# EAGLE design DRV8840 pcbway optimized (EAGLE 9.5.1)
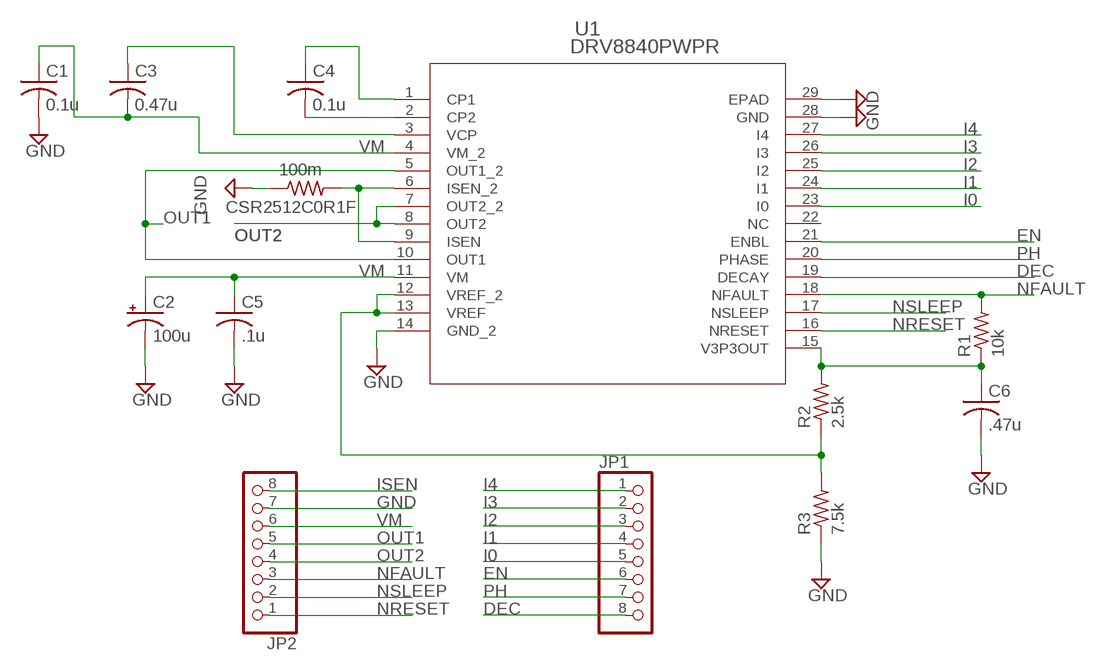
[diagram p0: schematic, sheet 1]

## Parts
C1  0.1u  C-US025-024X044  [C025-024X044]
C2  100u  CPOL-USE2.5-6  [E2,5-6]
C3  0.47u  C-USC1206  [C1206]
C4  0.1u  C-USC1206  [C1206]
C5  .1u  C-US025-024X044  [C025-024X044]
C6  .47u  C-US025-024X044  [C025-024X044]
CSR2512C0R1F  100m  R-US_R2512  [R2512]
JP1  PINHD-1X8  [1X08]
JP2  PINHD-1X8  [1X08]
R1  10k  R-US_0204/2V  [0204V]
R2  2.5k  R-US_0207/10  [0207/10]
R3  7.5k  R-US_0207/10  [0207/10]
U1  DRV8840PWPR  [PWP28_5P18X3P1]

## Nets
DEC: JP1.8 U1.19(DECAY)
EN: JP1.6 U1.21(ENBL)
GND: C1.2 C2.- C5.2 C6.2 CSR2512C0R1F.1 JP2.7 R3.1 U1.14(GND_2) U1.28(GND) U1.29(EPAD)
I0: JP1.5 U1.23(I0)
I1: JP1.4 U1.24(I1)
I2: JP1.3 U1.25(I2)
I3: JP1.2 U1.26(I3)
I4: JP1.1 U1.27(I4)
ISEN: CSR2512C0R1F.2 JP2.8 U1.6(ISEN_2) U1.9(ISEN)
N$2: C6.1 R1.1 R2.2 U1.15(V3P3OUT)
N$4: C4.2 U1.2(CP2)
N$5: C3.1 U1.3(VCP)
N$10: C4.1 U1.1(CP1)
N$11: R2.1 R3.2 U1.12(VREF_2) U1.13(VREF)
NFAULT: JP2.3 R1.2 U1.18(NFAULT)
NRESET: JP2.1 U1.16(NRESET)
NSLEEP: JP2.2 U1.17(NSLEEP)
OUT1: JP2.5 U1.5(OUT1_2) U1.10(OUT1)
OUT2: JP2.4 U1.7(OUT2_2) U1.8(OUT2)
PH: JP1.7 U1.20(PHASE)
VM: C1.1 C2.+ C3.2 C5.1 JP2.6 U1.4(VM_2) U1.11(VM)
Unconnected: U1.22(NC)

## Library data of the parts
C1 C3-C6 = rcl:C-US: CAPACITOR, American symbol; SPICEPREFIX: C
C2 = rcl:CPOL-US: POLARIZED CAPACITOR, American symbol; SPICEPREFIX: C
CSR2512C0R1F R1-R3 = rcl:R-US_: RESISTOR, American symbol; SPICEPREFIX: R
JP1 JP2 = pinhead:PINHD-1X8: PIN HEADER
U1 = wobbleBot:DRV8840PWPR; MANUFACTURER_PART_NUMBER: DRV8840PWPR; VENDOR: Texas Instruments

## Board
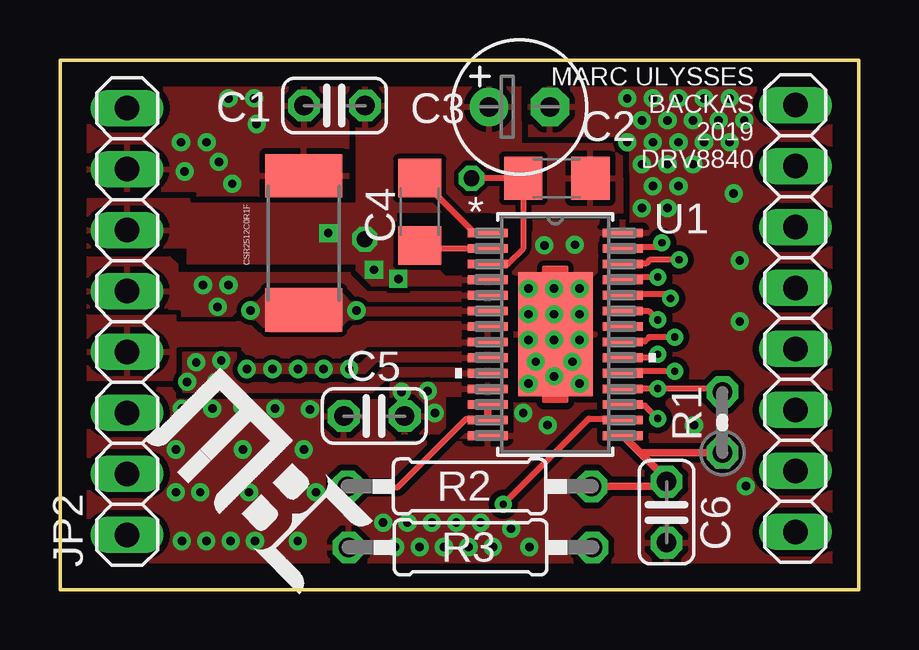
[diagram p1: board, top side]
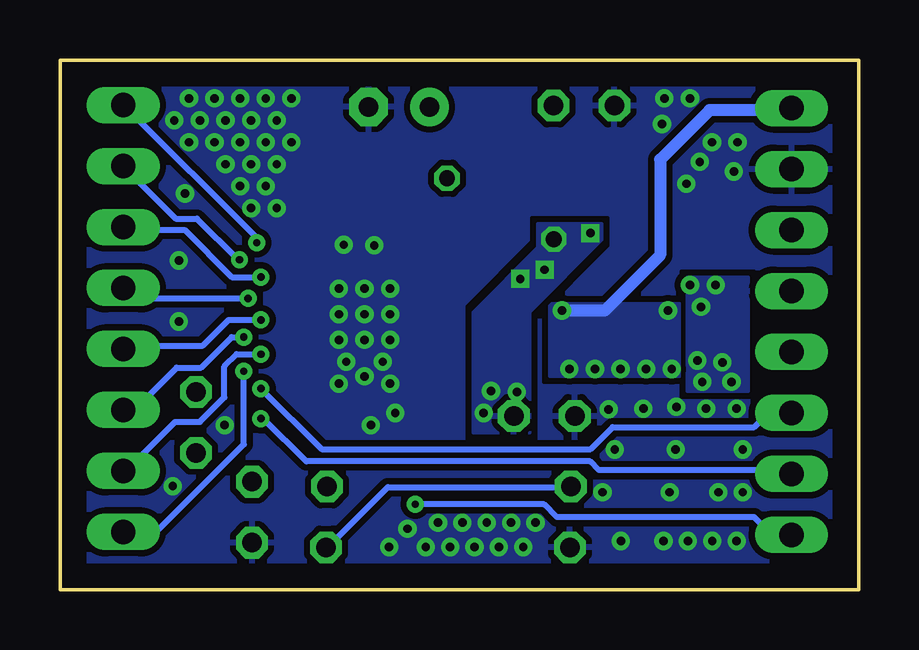
[diagram p2: board, bottom side, seen from below]

Size 33.27 x 22.07 mm. Coordinates in mm from the lower left corner, seen from the top.
Outline: 0,0 0,22.07 33.27,22.07 33.27,0 0,0
Copper layers (1*16): Top 0.035mm / dielectric 1.5mm / Bottom 0.035mm
Design rules "PCBway": minimum track width 6mil, minimum drill 0.3mm, track to track 0.205mm, track to pad 0.205mm, pad to pad 0.205mm, via to via 0.205mm, smd to smd 8mil, copper to edge 40mil, drill to drill 8mil, minimum pad ring 10mil, minimum via ring 8mil, stop-mask expansion 4mil, vias tented up to drill 25mil, thermal gap 10mil

### Footprints (pad centres in the part's own frame; a part is rotated, then mirrored left to right if it is on the bottom)
C025-024X044 = drill 0.813 octagon: 1 -1.27,0; 2 1.27,0
E2,5-6 = drill 0.813 pad 1.6: + -1.27,0 | drill 0.813 pad 1.6 octagon: - 1.27,0
C1206 = smd 1.6 x 1.8: 1 -1.4,0; 2 1.4,0
R2512 = smd 1.8 x 3.2: 1 -2.8,0; 2 2.8,0
1X08 = drill 1.016 long: 1 -8.89,0; 2 -6.35,0; 3 -3.81,0; 4 -1.27,0; 5 1.27,0; 6 3.81,0; 7 6.35,0; 8 8.89,0
0204V = drill 0.813 octagon: 1 -1.27,0; 2 1.27,0
0207/10 = drill 0.813 octagon: 1 -5.08,0; 2 5.08,0
PWP28_5P18X3P1 = smd 1.665 x 0.365: 1 -2.819,4.225; 2 -2.819,3.575; 3 -2.819,2.925; 4 -2.819,2.275; 5 -2.819,1.625; 6 -2.819,0.975; 7 -2.819,0.325; 8 -2.819,-0.325; 9 -2.819,-0.975; 10 -2.819,-1.625; 11 -2.819,-2.275; 12 -2.819,-2.925; 13 -2.819,-3.575; 14 -2.819,-4.225; 15 2.819,-4.225; 16 2.819,-3.575; 17 2.819,-2.925; 18 2.819,-2.275; 19 2.819,-1.625; 20 2.819,-0.975; 21 2.819,-0.325; 22 2.819,0.325; 23 2.819,0.975; 24 2.819,1.625; 25 2.819,2.275; 26 2.819,2.925; 27 2.819,3.575; 28 2.819,4.225 | smd 3.1 x 5.18: 29 0,0

### Placement (x,y rotation side)
C1  11.44,20.17 180 top
C2  19.15,20.12 0 top
C3  20.7,17.14 0 top
C4  14.99,15.75 270 top
C5  13.09,7.24 180 top
C6  25.27,3.23 270 top
CSR2512C0R1F  10.16,14.45 270 top
JP1  30.64,11.3 270 top
JP2  2.79,11.18 90 top
R1  27.6,6.97 90 top
R2  17.07,4.31 0 top
R3  17.11,1.77 0 top
U1  20.64,10.64 0 top

### Tracks (layer width: path | path; a pad name or v marks a point on that pad's centre or on a via)
DEC  (via drill 0.3)
  Top 0.152: 23.47,9.1 U1.19
  Top 0.254: v25.62,9.1 23.47,9.1
  Bottom 0.254: v25.62,9.1 25.62,6.06 29.37,2.31 30.42,2.31 JP1.8
EN  (via drill 0.3)
  Top 0.152: 23.47,10.35 U1.21
  Top 0.254: 23.47,10.35 24.36,10.35 24.54,10.53 v25.62,10.53
  Bottom 0.254: v25.62,10.53 26.12,10.53 27.39,9.26 28.41,9.26 30,7.67 30.42,7.67 JP1.6
GND  (via drill 0.35)
  Top 0.406: U1.29 21.65,9.63 v21.65,8.59
  other vias: 7.18,16.92 5.19,17.42 7.02,20.47 8.09,20.47 8.19,19.41 6.11,18.64 5.04,18.64 6.62,17.83 20.18,14.35 24.24,17.73 24.7,16.81 24.24,15.9 25.31,15.9 25.77,16.81 25.31,17.73 26.38,17.73 27.9,18.64 26.84,18.64 25.77,18.64 24.7,18.64 23.63,18.64 24.24,19.56 25.31,19.56 26.38,19.56 27.44,19.56 27.9,20.47 28.51,19.56 26.84,20.47 25.77,20.47 24.7,20.47 23.63,20.47 19.52,12.55 20.59,12.55 21.65,12.55 19.52,11.48 20.59,11.48 21.65,11.48 21.65,10.41 20.59,10.41 19.52,10.41 19.82,9.5 21.35,9.5 20.59,8.89 19.52,8.59 21.45,14.38 5.08,7.54 4.83,5.84 7.62,5.84 10.16,5.84 6.35,7.54 7.59,7.62 8.97,7.54 10.41,7.52 4.83,4.06 5.84,4.06 7.87,4.06 10.67,4.06 5.08,2.03 6.1,2.03 7.11,2.03 8.13,2.03 9.91,2.03 13.46,2.79 14.48,2.79 15.49,2.79 16.51,2.79 17.53,2.79 18.8,2.54 18.03,1.78 19.56,1.78 17.02,1.78 16,1.78 14.99,1.78 13.97,1.78 19.3,7.37 20.32,6.86 28.32,13.72 28.32,11.18 28.57,4.32 26.42,6.86 28.07,16.51
  pour Top (isolate 0.254, rank 5): 0.01,0 0.01,22.07 33.19,22.07 33.19,0
  pour Bottom (isolate 0.254, rank 5): 0.01,0 0.01,22.07 33.19,22.07 33.19,0
  pour Top (no thermals): 21.53,12.42 22.42,13.31 22.42,14.99 19.82,14.99 18.91,14.07 18.91,13.19
I0  (via drill 0.3)
  Top 0.152: 23.47,11.6 U1.23
  Top 0.254: 23.47,11.6 24.54,11.6 v24.9,11.24
  Bottom 0.254: v24.9,11.24 26.25,11.24 27.32,10.17 30.42,10.17 JP1.5
I1  (via drill 0.3)
  Top 0.152: 23.47,12.32 U1.24
  Top 0.254: 23.47,12.32 25.26,12.32 v25.44,12.14
  Bottom 0.254: v25.44,12.14 29.73,12.14 30.26,12.67 30.42,12.67 JP1.4
I2  (via drill 0.3)
  Top 0.152: 23.47,13.03 U1.25
  Top 0.254: v24.9,13.03 23.47,13.03
  Bottom 0.152: 30.42,15 JP1.3
  Bottom 0.254: v24.9,13.03 26.11,13.03 28.08,15 30.42,15
I3  (via drill 0.3)
  Top 0.152: 23.46,13.59 U1.26
  Top 0.254: v25.79,13.75 24.57,13.75 24.42,13.59 23.46,13.59
  Bottom 0.254: v25.79,13.75 25.85,13.75 27.57,15.46 28.45,15.46 JP1.2
I4  (via drill 0.3)
  Top 0.152: 23.47,14.28 U1.27
  Top 0.254: 23.47,14.28 24.9,14.28 v25.08,14.46
  Bottom 0.254: v25.08,14.46 25.08,14.66 30.56,20.13 JP1.1
ISEN  (via drill 0.35)
  Bottom 0.508: JP2.8 2.87,19.99 6.2,19.99 8.27,17.92 8.27,13.95 10.58,11.63 v12.36,11.63
  other vias: 7.94,11.63 7.79,9.19 8.85,9.19 9.92,9.19 10.99,9.19 12.05,9.19
  pour Top (rank 4): 18.41,11.91 18.41,11.44 8.22,11.44 8.22,11.91
  pour Top: 18.57,9.85 13.02,9.85 12.54,9.37 7.72,9.37 7.72,9.06 12.7,9.06 13.18,9.53 18.57,9.53
  pour Bottom (rank 2): 7.46,11.91 7.46,8.9 12.86,8.9 12.86,11.91
  pour Top (rank 4, no thermals): 8.46,10.72 7.62,11.56 8.61,12.55 11.81,12.55 12.73,11.63 11.81,10.72
N$2
  Top 0.305: R1.1 24.17,5.7 U1.15 25.27,4.6 C6.1 25.08,4.3 R2.2
N$4
  Top 0.152: 15.12,14.22 C4.2
  Top 0.254: U1.2 15.12,14.22
N$5  (via drill 0.65)
  Top 0.254: U1.3 18.66,13.58 19.3,14.22 C3.1 v17.14,17.14
N$10
  Top 0.152: U1.1 17.27,14.87
  Top 0.254: 17.27,14.87 C4.1
N$11
  Top 0.152: 12.03,4.27 R2.1
  Top 0.254: U1.13 17.78,7.11 16.91,7.11 14.07,4.27 12.03,4.27
  Top 0.305: U1.12 U1.13
  Bottom 0.152: 12.03,4.27 R2.1
  Bottom 0.254: 12.03,4.27 19.61,4.27 22.12,1.77 R3.2
NFAULT  (via drill 0.3)
  Top 0.152: 23.47,8.38 U1.18
  Top 0.254: 23.47,8.38 v24.9,8.38 27.51,8.38 R1.2
  Bottom 0.254: v24.9,8.38 22.37,5.86 11.17,5.86 10.25,6.78 4.35,6.78 3.81,7.31 2.81,7.31 2.81,7.35 JP2.3
NRESET  (via drill 0.3)
  Top 0.152: 23.29,7.13 U1.16
  Top 0.254: 23.29,7.13 22.04,7.13 v18.47,3.56
  Bottom 0.254: v18.47,3.56 13.11,3.56 12.57,3.02 4.35,3.02 3.81,2.49 3,2.49 JP2.1
NSLEEP  (via drill 0.3)
  Top 0.152: 23.47,7.67 U1.17
  Top 0.254: 23.47,7.67 24.36,7.67 v24.9,7.13
  Bottom 0.254: v24.9,7.13 24.8,7.13 23.01,5.35 11.18,5.35 10.82,4.99 2.79,4.99 JP2.2
OUT1  (via drill 0.35)
  other vias: 5.3,8.66 5.68,9.47 6.72,9.55 6.52,8.66 5.96,12.7 7.02,12.7 6.57,11.79
  pour Top (rank 2): 18.57,12.07 12.54,12.07 11.91,12.71 8.41,12.71 7.14,11.44 4.6,11.44 4.6,13.18 12.07,13.18 12.86,12.39 18.57,12.39
  pour Top (rank 2): 18.57,9.21 13.49,9.21 12.86,8.58 7.62,8.58 7.3,8.9 7.3,9.85 5.16,9.85 5.16,8.26 13.02,8.26 13.65,8.9 18.57,8.9
  pour Bottom: 4.6,8.26 4.6,13.02 7.14,13.02 7.14,8.26
  pour Top: 4.86,11.79 0.79,11.79 0.79,13.82 4.57,13.82 4.86,13.53
OUT2
  pour Top (rank 3): 18.57,11.12 12.38,11.12 11.91,10.64 8.26,10.64 7.79,11.12 4.6,11.12 4.6,10.17 7.46,10.17 7.94,9.69 12.38,9.69 12.86,10.17 18.57,10.17
  pour Top: 4.78,11.4 0.79,11.4 0.79,8.76 4.78,8.76
PH  (via drill 0.3)
  Top 0.254: U1.20 24.75,9.66 v24.9,9.81
  Bottom 0.254: v24.9,9.81 25.92,9.81 26.43,9.3 26.43,8.02 27.45,7 28.48,7 30.51,4.96 JP1.7
VM  (via drill 0.35, 0.65)
  other vias: 14.24,8.24 15.32,8.28 15.62,7.37 12.7,14.61 13.08,13.34 14.1,12.95 11.18,14.86
  pour Bottom: 13.71,6.53 16.06,6.53 16.06,11.57 13.36,14.27 13.36,15.25 10.71,15.25 10.71,14.57 13.71,11.57
  pour Top: 18.57,8.58 13.81,8.58 13.81,6.53 16.01,6.53 16.01,8.1 18.57,8.1
  pour Top: 18.57,12.71 13.02,12.71 12.38,13.34 12.38,22.07 19.15,22.07 19.18,18.67 19.18,18.54 23.39,18.54 23.41,15.74 18.01,15.76 18,15.76 13.97,15.76 13.97,15.09 16.03,13.02 18.57,13.02
  pour Top: 5.37,16.24 0.79,16.24 0.79,14.29 5.37,14.29
  pour Top: 5.35,16.05 12.36,16.05 12.36,13.61 5.35,13.61

### Text on the board
tPlace: MARC ULYSSES / BACKAS / 2019 / DRV8840